# EAGLE design RecoveryBoard (EAGLE 9.6.2)

## Sheet 1 of 2: Power
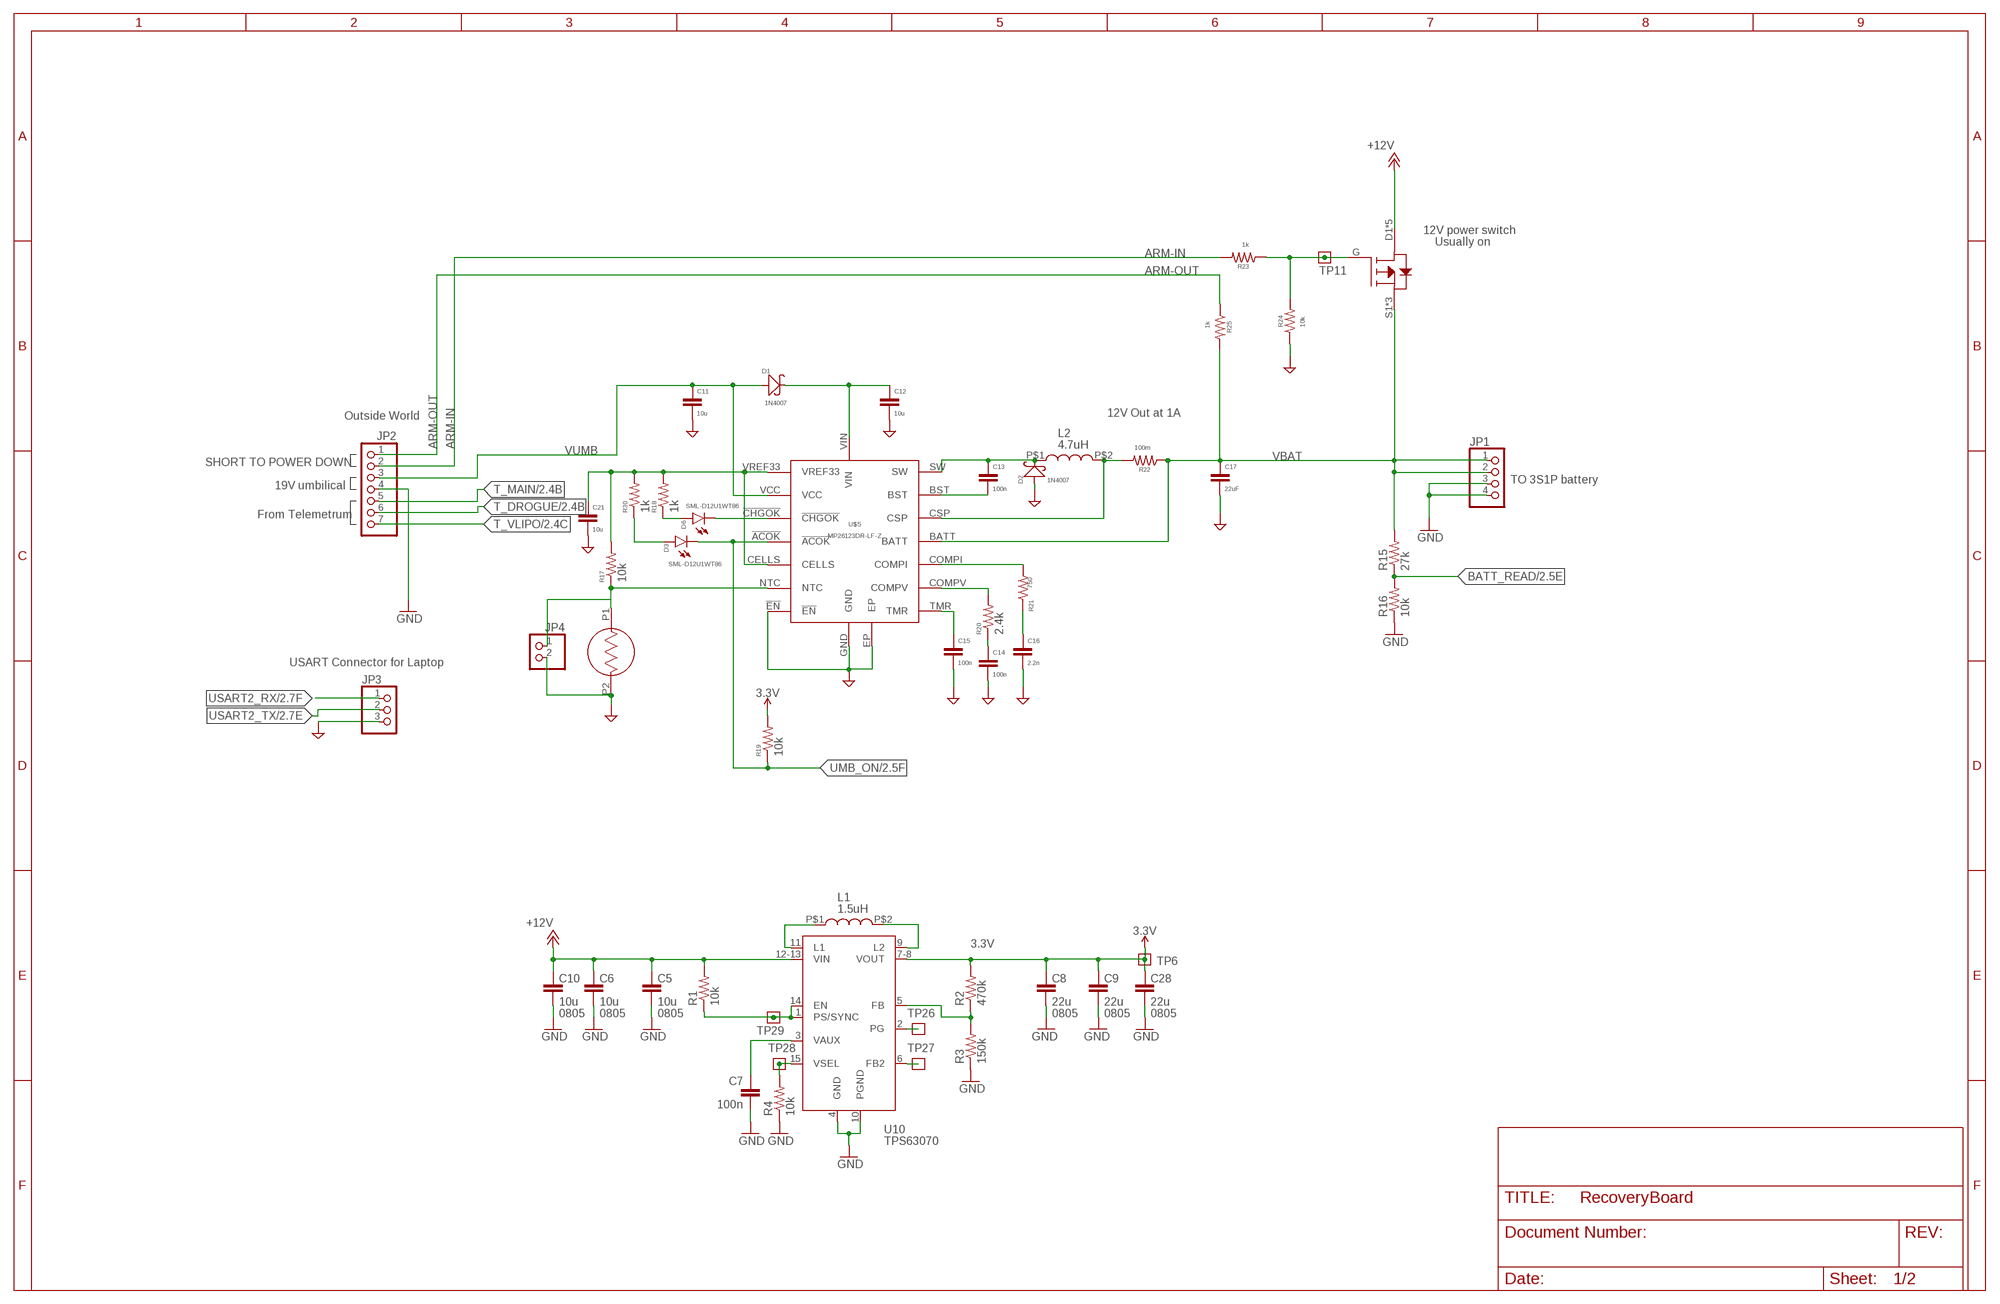
[diagram p0: schematic, sheet 1]

### Parts
C5  10u  C-EU0805-C-NOSILK  [.0805-C-NOSILK]
C6  10u  C-EU0805-C-NOSILK  [.0805-C-NOSILK]
C7  100n  C-EU0603-C-NOSILK  [.0603-C-NOSILK]
C8  22u  C-EU0805-C-NOSILK  [.0805-C-NOSILK]
C9  22u  C-EU0805-C-NOSILK  [.0805-C-NOSILK]
C10  10u  C-EU0805-C-NOSILK  [.0805-C-NOSILK]
C11  10u  C-EU0805-C-NOSILK  [.0805-C-NOSILK]
C12  10u  C-EU0805-C-NOSILK  [.0805-C-NOSILK]
C13  100n  C-EU0603-C-NOSILK  [.0603-C-NOSILK]
C14  100n  C-EU0603-C-NOSILK  [.0603-C-NOSILK]
C15  100n  C-EU0603-C-NOSILK  [.0603-C-NOSILK]
C16  2.2n  C-EU0603-C-NOSILK  [.0603-C-NOSILK]
C17  22uF  C-EU0805-C-NOSILK  [.0805-C-NOSILK]
C21  10u  C-EU0805-C-NOSILK  [.0805-C-NOSILK]
C28  22u  C-EU0805-C-NOSILK  [.0805-C-NOSILK]
D1  1N4007  DIODE-SCHOTTKY-(DO-214AC)  [DO-214AC]
D2  1N4007  DIODE-SCHOTTKY-(DO-214AC)  [DO-214AC]
D3  SML-D12U1WT86  LEDCHIPLED_0603  [CHIPLED_0603]
D6  SML-D12U1WT86  LEDCHIPLED_0603  [CHIPLED_0603]
JP1  PINHD-1X4  [1X04]
JP2  PINHD-1X7  [1X07]
JP3  PINHD-1X3  [1X03]
JP4  PINHD-1X2  [1X02]
L1  1.5uH  IHLP2020CZER1R5M11  [IHLP2020CZER1R5M11]
L2  4.7uH  IHLP2020BZER4R7M11  [IHLP2020BZER4R7M11]
Q7  SI7465DP-T1-E3  [SI7465DP-T1-E3CT-ND]
R1  10k  R-US_0603-C-NOSILK  [.0603-C-NOSILK]
R2  470k  R-US_0603-C-NOSILK  [.0603-C-NOSILK]
R3  150k  R-US_0603-C-NOSILK  [.0603-C-NOSILK]
R4  10k  R-US_0603-C-NOSILK  [.0603-C-NOSILK]
R5  NHQ103B375T10  [NHQ103B375T10]
R15  27k  R-US_0603-C-NOSILK  [.0603-C-NOSILK]
R16  10k  R-US_0603-C-NOSILK  [.0603-C-NOSILK]
R17  10k  R-US_0603-C-NOSILK  [.0603-C-NOSILK]
R18  1k  R-US_0603-C-NOSILK  [.0603-C-NOSILK]
R19  10k  R-US_0603-C-NOSILK  [.0603-C-NOSILK]
R20  2.4k  R-US_0603-C-NOSILK  [.0603-C-NOSILK]
R21  750  R-US_0603-C-NOSILK  [.0603-C-NOSILK]
R22  100m  R-US_1206-C  [1206-C]
R23  1k  R-US_0603-C-NOSILK  [.0603-C-NOSILK]
R24  10k  R-US_0603-C-NOSILK  [.0603-C-NOSILK]
R25  1k  R-US_0603-C-NOSILK  [.0603-C-NOSILK]
R30  1k  R-US_0603-C-NOSILK  [.0603-C-NOSILK]
TP6  TEST-POINT  [2MM-TEST-POINT]
TP11  TEST-POINT  [2MM-TEST-POINT]
TP26  TEST-POINT  [2MM-TEST-POINT]
TP27  TEST-POINT  [2MM-TEST-POINT]
TP28  TEST-POINT  [2MM-TEST-POINT]
TP29  TEST-POINT  [2MM-TEST-POINT]
U10  TPS63070  TPS63070X  [TPS63070X]
U$5  MP26123DR-LF-Z  [MP26123DR-LF-Z]

### Nets
3.3V: C8.1 C9.1 C28.1 R2.2 R19.2 TP6.1 U10.7-8(VOUT) ; also sheet 2
!BEN: C12.1 D1.2(-) U$5.VIN
+12V: C5.1 C6.1 C10.1 Q7.D1(D) Q7.D2(D) Q7.D3(D) Q7.D4(D) Q7.DPAD(D) R1.2 U10.12-13(VIN) ; also sheet 2
ARM-IN: JP2.2 R23.2
ARM-OUT: JP2.1 R25.1
BATT_READ: R15.1 R16.2 ; also sheet 2
GND: C5.2 C6.2 C7.2 C8.2 C9.2 C10.2 C11.2 C12.2 C14.2 C15.2 C16.2 C17.2 C21.2 C28.2 D2.1(+) JP1.3 JP1.4 JP2.4 JP3.3 JP4.2 R3.1 R4.1 R5.P2 R16.1 R24.1 U10.4(GND) U10.10(PGND) U$5.!EN U$5.EP U$5.GND ; also sheet 2
N$10: C13.1 D2.2(-) L2.P$1 U$5.SW
N$11: C13.2 U$5.BST
N$12: C21.1 R17.2 R18.2 R30.2 U$5.CELLS U$5.VREF33
N$13: D6.C U$5.!CHGOK
N$14: D3.A R30.1
N$16: Q7.G R23.1 R24.2 TP11.1
N$17: D6.A R18.1
N$18: R20.2 U$5.COMPV
N$19: C15.1 U$5.TMR
N$20: JP4.1 R5.P1 R17.1 U$5.NTC
N$21: R21.2 U$5.COMPI
N$22: C16.1 R21.1
N$28: L2.P$2 R22.2 U$5.CSP
N$30: C14.1 R20.1
T_DROGUE: JP2.6 ; also sheet 2
T_MAIN: JP2.5 ; also sheet 2
T_VLIPO: JP2.7 ; also sheet 2
TPS-EN: R1.1 TP29.1 U10.1(PS/SYNC) U10.14(EN)
TPS-FB: R2.1 R3.2 U10.5(FB)
TPS-FB2: TP27.1 U10.6(FB2)
TPS-L1: L1.P$1 U10.11(L1)
TPS-L2: L1.P$2 U10.9(L2)
TPS-PG: TP26.1 U10.2(PG)
TPS-VAUX: C7.1 U10.3(VAUX)
TPS-VSEL: R4.2 TP28.1 U10.15(VSEL)
UMB_ON: D3.C R19.1 U$5.!ACOK ; also sheet 2
USART2_RX: JP3.1 ; also sheet 2
USART2_TX: JP3.2 ; also sheet 2
VBAT: C17.1 JP1.1 JP1.2 Q7.S1(S) Q7.S2(S) Q7.S3(S) R15.2 R22.1 R25.2 U$5.BATT
VUMB: C11.1 D1.1(+) JP2.3 U$5.VCC

### Notes on the sheet
- 12V power switch
- Usually on
- Outside World | 12V Out at 1A
- SHORT TO POWER DOWN
- TO 3S1P battery
- 19V umbilical
- From Telemetrum
- USART Connector for Laptop
- 0805 | 0805 | 0805 | 0805 | 0805 | 0805

## Sheet 2 of 2: Microcontroller
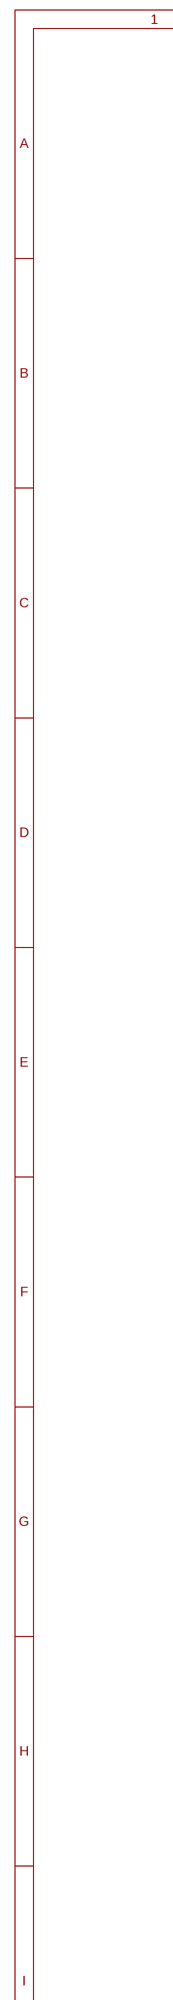
[diagram p1: schematic, sheet 2, part 1 of 2]
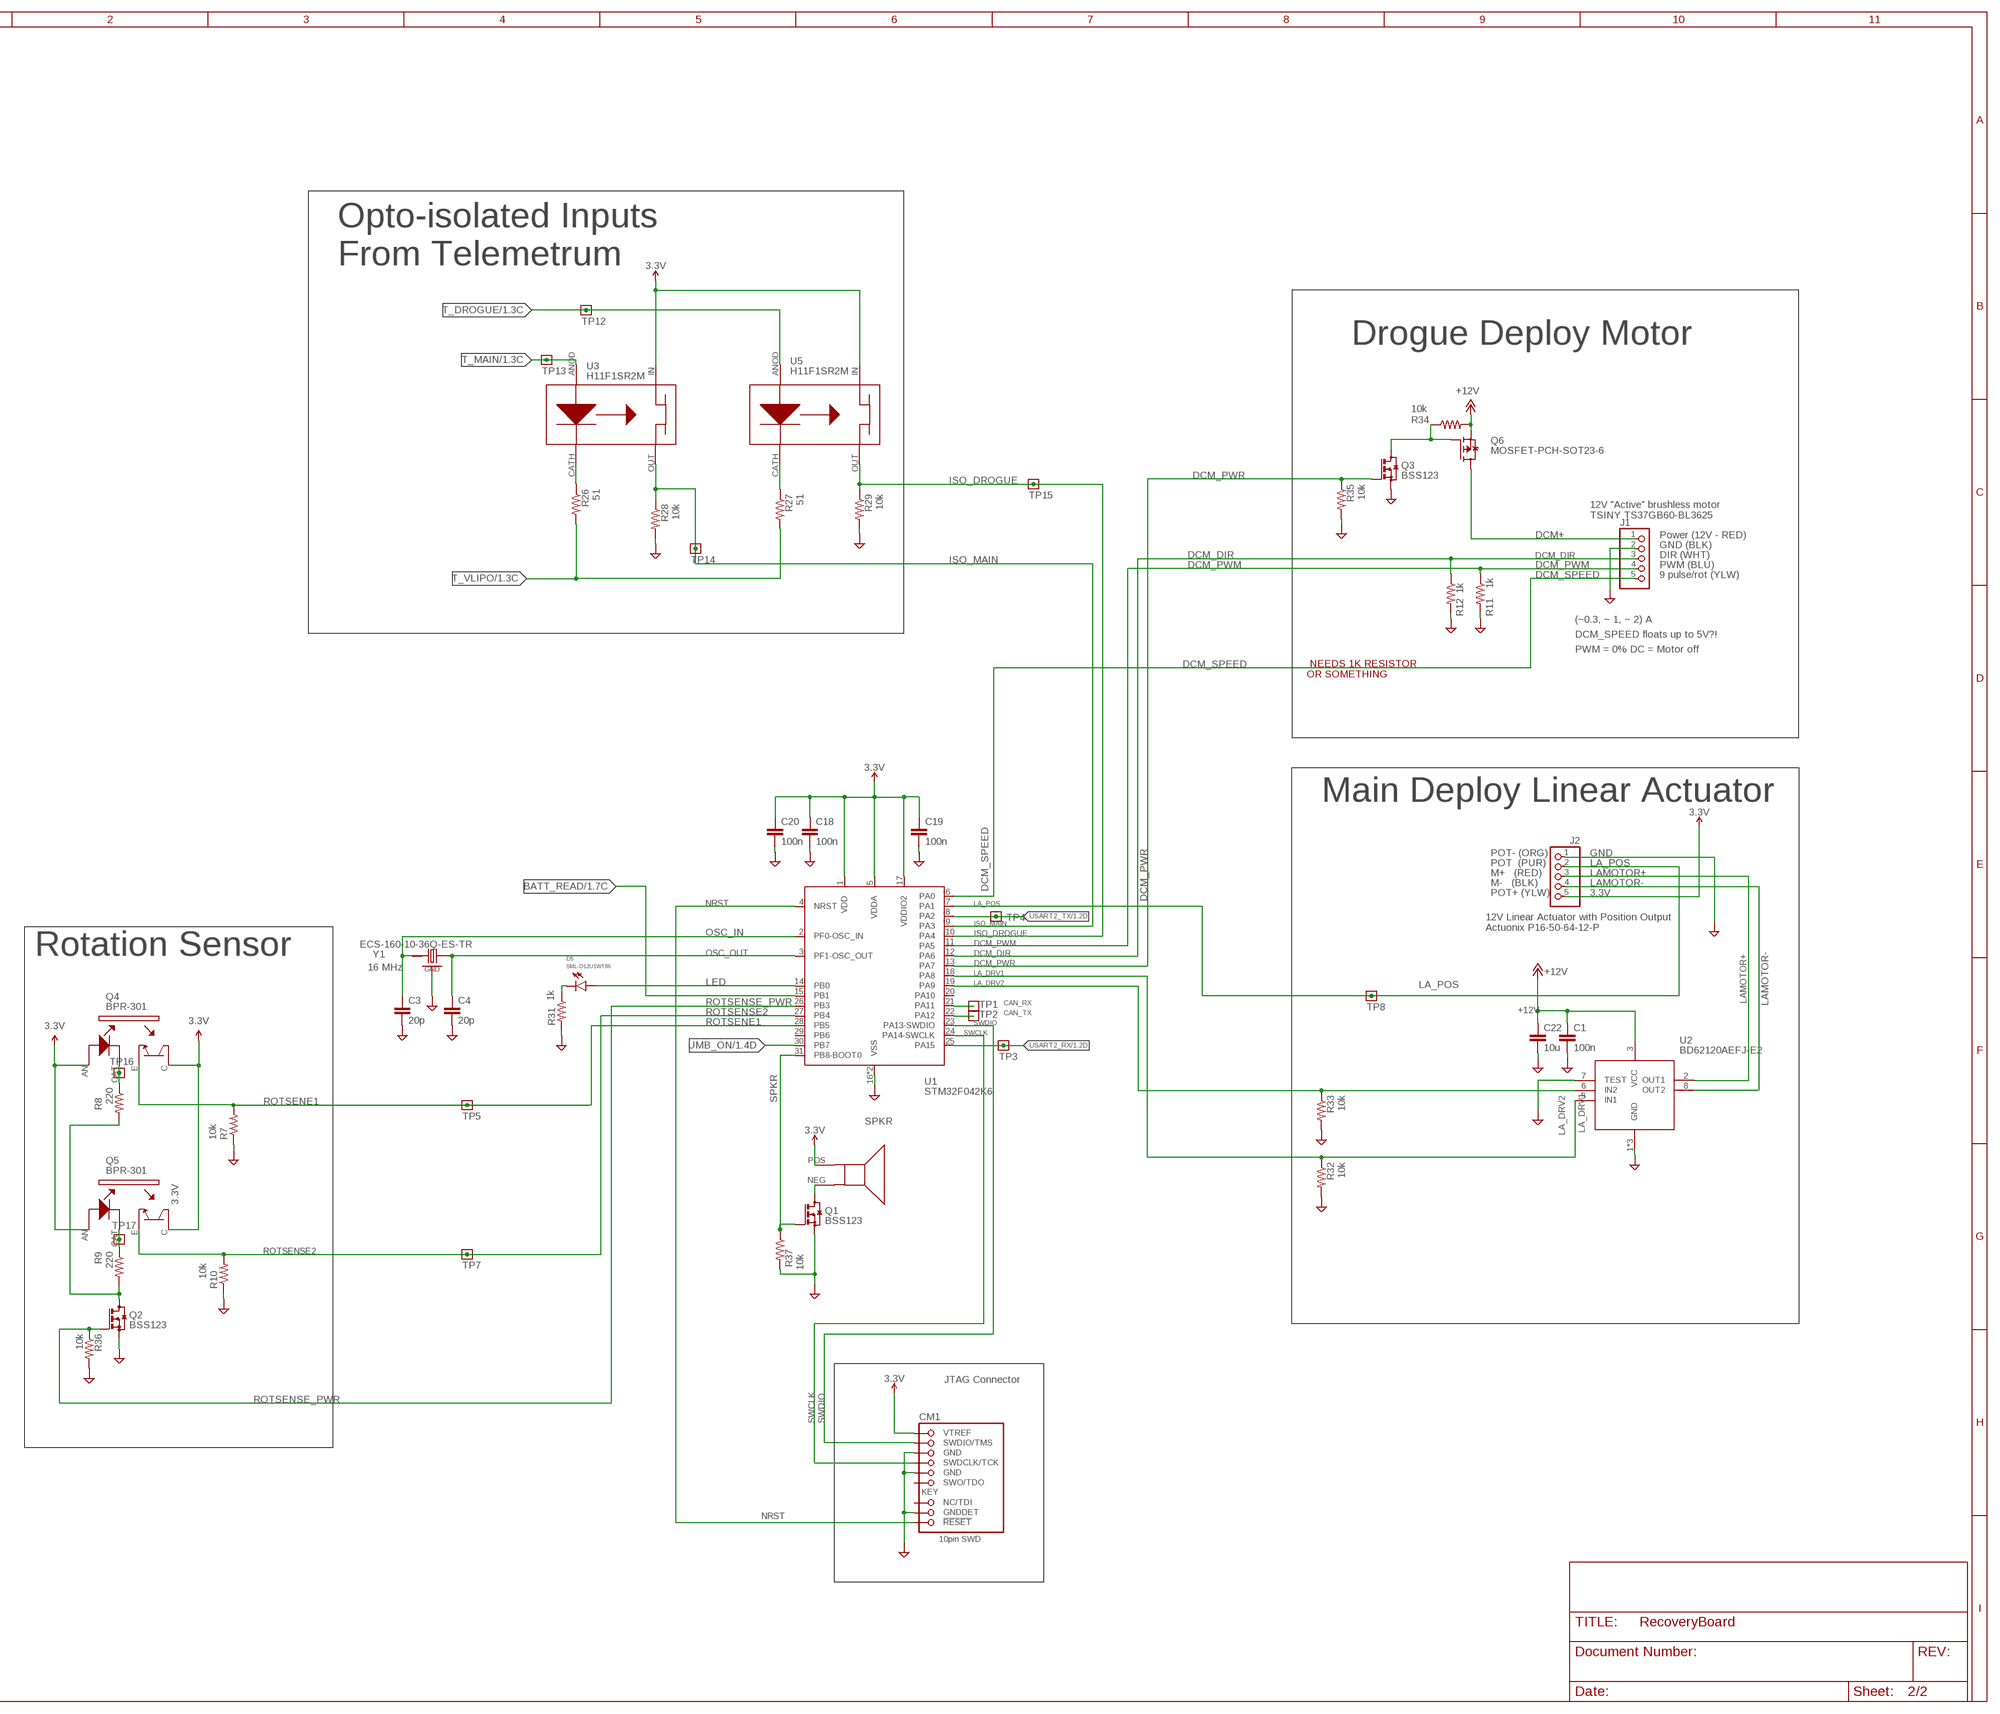
[diagram p2: schematic, sheet 2, part 2 of 2]

### Parts
C1  100n  C-EU0603-C-NOSILK  [.0603-C-NOSILK]
C3  20p  C-EU0603-C-NOSILK  [.0603-C-NOSILK]
C4  20p  C-EU0603-C-NOSILK  [.0603-C-NOSILK]
C18  100n  C-EU0603-C-NOSILK  [.0603-C-NOSILK]
C19  100n  C-EU0603-C-NOSILK  [.0603-C-NOSILK]
C20  100n  C-EU0603-C-NOSILK  [.0603-C-NOSILK]
C22  10u  C-EU0805-A-NOSILK  [.0805-A-NOSILK]
CM1  FTSH-105-XX-X-DV-K  [CON10_2X5_DUK_FTSH]
D5  SML-D12U1WT86  LEDCHIPLED_0603  [CHIPLED_0603]
J1  PINHD-1X5  [1X05]
J2  PINHD-1X5  [1X05]
Q1  BSS123  [SOT23]
Q2  BSS123  [SOT23]
Q3  BSS123  [SOT23]
Q4  BPR-301  [BPR-301]
Q5  BPR-301  [BPR-301]
Q6  MOSFET-PCH-SOT23-6  [SOT23-6]
R7  10k  R-US_0603-C-NOSILK  [.0603-C-NOSILK]
R8  220  R-US_0603-C-NOSILK  [.0603-C-NOSILK]
R9  220  R-US_0603-C-NOSILK  [.0603-C-NOSILK]
R10  10k  R-US_0603-C-NOSILK  [.0603-C-NOSILK]
R11  1k  R-US_0603-C-NOSILK  [.0603-C-NOSILK]
R12  1k  R-US_0603-C-NOSILK  [.0603-C-NOSILK]
R26  51  R-US_0603-C-NOSILK  [.0603-C-NOSILK]
R27  51  R-US_0603-C-NOSILK  [.0603-C-NOSILK]
R28  10k  R-US_0603-C-NOSILK  [.0603-C-NOSILK]
R29  10k  R-US_0603-C-NOSILK  [.0603-C-NOSILK]
R31  1k  R-US_0603-C-NOSILK  [.0603-C-NOSILK]
R32  10k  R-US_0603-C-NOSILK  [.0603-C-NOSILK]
R33  10k  R-US_0603-C-NOSILK  [.0603-C-NOSILK]
R34  10k  R-US_0603-C-NOSILK  [.0603-C-NOSILK]
R35  10k  R-US_0603-C-NOSILK  [.0603-C-NOSILK]
R36  10k  R-US_0603-C-NOSILK  [.0603-C-NOSILK]
R37  10k  R-US_0603-C-NOSILK  [.0603-C-NOSILK]
TP1  TEST-POINT  [2MM-TEST-POINT]
TP2  TEST-POINT  [2MM-TEST-POINT]
TP3  TEST-POINT  [2MM-TEST-POINT]
TP4  TEST-POINT  [2MM-TEST-POINT]
TP5  TEST-POINT  [2MM-TEST-POINT]
TP7  TEST-POINT  [2MM-TEST-POINT]
TP8  TEST-POINT  [2MM-TEST-POINT]
TP12  TEST-POINT  [2MM-TEST-POINT]
TP13  TEST-POINT  [2MM-TEST-POINT]
TP14  TEST-POINT  [2MM-TEST-POINT]
TP15  TEST-POINT  [2MM-TEST-POINT]
TP16  TEST-POINT  [2MM-TEST-POINT]
TP17  TEST-POINT  [2MM-TEST-POINT]
U1  STM32F042K6  [QFP32-7X7]
U2  BD62120AEFJ-E2  [SOIC127P600X100-9N]
U3  H11F1SR2M  [H11F1SR2M]
U5  H11F1SR2M  [H11F1SR2M]
U$7  SMT-0440-S-R  [SMT-0440-S-R]
Y1  ECS-160-10-36Q-ES-TR  [XTAL_ECS-160-10-36Q-ES-TR]

### Nets
3.3V: C18.1 C19.1 C20.1 CM1.1(VTREF) J2.5 Q4.AN(ANOD) Q4.C(COLL) Q5.AN(ANOD) Q5.C(COLL) U1.1(VDD) U1.5(VDDA) U1.17(VDDIO2) U3.IN U5.IN U$7.POS ; also sheet 1
+12V: C1.1 C22.1 Q6.4(S) R34.2 U2.3(VCC) ; also sheet 1
BATT_READ: U1.15(PB1) ; also sheet 1
CAN_RX: TP1.1 U1.21(PA11)
CAN_TX: TP2.1 U1.22(PA12)
DCM+: J1.1 Q6.1(D) Q6.2(D) Q6.5(D) Q6.6(D)
DCM_DIR: J1.3 R12.1 U1.12(PA6)
DCM_PWM: J1.4 R11.1 U1.11(PA5)
DCM_PWR: Q3.1(G) R35.1 U1.13(PA7)
DCM_SPEED: J1.5 U1.6(PA0)
GND: C1.2 C3.2 C4.2 C18.2 C19.2 C20.2 C22.2 CM1.3(GND) CM1.5(GND) CM1.9(GNDDET) J1.2 J2.1 Q1.2(S) Q2.2(S) Q3.2(S) R7.1 R10.1 R11.2 R12.2 R28.2 R29.2 R31.2 R32.2 R33.2 R35.2 R36.2 R37.2 U1.16(VSS) U1.32(VSS) U2.1(GND) U2.4(GND) U2.7(TEST) U2.9(GND) Y1.GND Y1.GND2(GND) ; also sheet 1
ISO_DROGUE: R29.1 TP15.1 U1.10(PA4) U5.OUT
ISO_MAIN: R28.1 TP14.1 U1.9(PA3) U3.OUT
LA_DRV1: R32.1 U1.18(PA8) U2.5(IN1)
LA_DRV2: R33.1 U1.19(PA9) U2.6(IN2)
LA_POS: J2.2 TP8.1 U1.7(PA1)
LAMOTOR+: J2.3 U2.2(OUT1)
LAMOTOR-: J2.4 U2.8(OUT2)
LED: D5.A U1.14(PB0)
N$1: Q1.3(D) U$7.NEG
N$2: Q4.CAT(CATH) R8.1 TP16.1
N$4: D5.C R31.1
N$5: Q5.CAT(CATH) R9.1 TP17.1
N$6: Q3.3(D) Q6.3(G) R34.1
N$7: R26.1 U3.CATH(CAT)
N$26: R27.1 U5.CATH(CAT)
N$27: Q2.3(D) R8.2 R9.2
NRST: CM1.10(!RESET) U1.4(NRST)
OSC_IN: C3.1 U1.2(PF0-OSC_IN) Y1.IN/OUT
OSC_OUT: C4.1 U1.3(PF1-OSC_OUT) Y1.OUT/IN
ROTSENE1: Q4.E(EMIT) R7.2 TP5.1 U1.28(PB5)
ROTSENSE2: Q5.E(EMIT) R10.2 TP7.1 U1.27(PB4)
ROTSENSE_PWR: Q2.1(G) R36.1 U1.26(PB3)
SPKR: Q1.1(G) R37.1 U1.31(PB8-BOOT0)
SWCLK: CM1.4(SWDCLK/TCK) U1.24(PA14-SWCLK)
SWDIO: CM1.2(SWDIO/TMS) U1.23(PA13-SWDIO)
T_DROGUE: TP12.1 U5.ANOD ; also sheet 1
T_MAIN: TP13.1 U3.ANOD ; also sheet 1
T_VLIPO: R26.2 R27.2 ; also sheet 1
UMB_ON: U1.30(PB7) ; also sheet 1
USART2_RX: TP3.1 U1.25(PA15) ; also sheet 1
USART2_TX: TP4.1 U1.8(PA2) ; also sheet 1
Unconnected: CM1.6(SWO/TDO) CM1.8(NC/TDI) U1.20(PA10) U1.29(PB6)

### Notes on the sheet
- Opto-isolated Inputs
  From Telemetrum
- Drogue Deploy Motor
- 12V "Active" brushless motor
  TSINY TS37GB60-BL3625
- Power (12V - RED)
- GND (BLK)
- DIR (WHT)
- PWM (BLU)
- 9 pulse/rot (YLW)
- (~0.3, ~ 1, ~ 2) A
- DCM_SPEED floats up to 5V?!
- PWM = 0% DC = Motor off
- NEEDS 1K RESISTOR 
  OR SOMETHING
- Main Deploy Linear Actuator
- POT- (ORG)
- POT  (PUR)
- M+   (RED)
- M-   (BLK)
- POT+ (YLW)
- 12V Linear Actuator with Position Output
  Actuonix P16-50-64-12-P
- Rotation Sensor
- 16 MHz
- JTAG Connector

## Library data of the parts
C1 C3 C4 C6 C9-C22 C28 = oresat-rcl:C-EU: CAPACITOR, European symbol
C5 C7 C8 = oresat-rcl:C-EU: CAPACITOR, European symbol; DIS: Digi-Key; DPN: 1276-1001-1-ND; MFR: Samsung; MPN: CL05B104KO5NNNC
CM1 = J-Samtec-FTSH-105-XXX-DV-K-ARM-SWD:FTSH-105-XX-X-DV-K
D1 D2 = D-Generic-Schottky-DO-214AC-SMA:DIODE-SCHOTTKY-(DO-214AC): 304010013; MPN: 1N4007
D3 D5 D6 = led:LED: LED OSRAM: - CHIPLED LG R971, LG N971, LY N971, LG Q971, LY Q971, LO R971, LY R971 LH N974, LH R974 LS Q976, LO Q976, LY Q976 LO Q996 - Hyper CHIPLED LW Q18S LB Q993, LB Q99A, LB R99A - SideLED LS A670, LO A670, LY A670, LG A670, LP A670 LB A673, LV A673, LT A673, LW A673 LH A674 LY A675 LS A676, LA A676, LO A676, LY A676, LW A676 LS A679, LY A679, LG A679 - Hyper Micro SIDELED® LS Y876, LA Y876, LO Y876, LY Y876 LT Y87S - SmartLED LW L88C, LW L88S LB L89C, LB L89S, LG L890 LS L89K, LO L89K, LY L89K LS L896, LA L896, LO L896, LY L896 - TOPLED LS T670, LO T670, LY T670, LG T670, LP T670 LSG T670, LSP T670, LSY T670, LOP T670, LYG T670 LG T671, LOG T671, LSG T671 LB T673, LV T673, LT T673, LW T673 LH T674 LS T676, LA T676, LO T676, LY T676, LB T676, LH T676, LSB T676, LW T676 LB T67C, LV T67C, LT T67C, LS T67K, LO T67K, LY T67K, LW E67C LS E67B, LA E67B, LO E67B, LY E67B, LB E67C, LV E67C, LT E67C LW T67C LS T679, LY T679, LG T679 LS T770, LO T770, LY T770, LG T770, LP T770 LB T773, LV T773, LT T773, LW T773 LH T774 LS E675, LA E675, LY E675, LS T675 LS T776, LA T776, LO T776, LY T776, LB T776 LHGB T686 LT T68C, LB T68C - Hyper Mini TOPLED® LB M676 - Mini TOPLED Santana® LG M470 LS M47K, LO M47K, LY M47K Source: http://www.osram.convergy.de LUXEON: - LUMILED® LXK2-PW12-R00, LXK2-PW12-S00, LXK2-PW14-U00, LXK2-PW14-V00 LXK2-PM12-R00, LXK2-PM12-S00, LXK2-PM14-U00 LXK2-PE12-Q00, LXK2-PE12-R00, LXK2-PE12-S00, LXK2-PE14-T00, LXK2-PE14-U00 LXK2-PB12-K00, LXK2-PB12-L00, LXK2-PB12-M00, LXK2-PB14-N00, LXK2-PB14-P00, LXK2-PB14-Q00 LXK2-PR12-L00, LXK2-PR12-M00, LXK2-PR14-Q00, LXK2-PR14-R00 LXK2-PD12-Q00, LXK2-PD12-R00, LXK2-PD12-S00 LXK2-PH12-R00, LXK2-PH12-S00 LXK2-PL12-P00, LXK2-PL12-Q00, LXK2-PL12-R00 Source: www.luxeon.com KINGBRIGHT: KA-3528ASYC Source: www.kingbright.com; DIS: Digikey; DPN: SML-D12U1WT86CT-ND; MPN: SML-D12U1WT86
J1 J2 = pinhead:PINHD-1X5: PIN HEADER
JP1 = pinhead:PINHD-1X4: PIN HEADER
JP2 = pinhead:PINHD-1X7: PIN HEADER
JP3 = pinhead:PINHD-1X3: PIN HEADER
JP4 = pinhead:PINHD-1X2: PIN HEADER
L1 = L--IHLP2020CZER1R5M11--1.5uHInductor:IHLP2020CZER1R5M11; DIS: Digi-Key; DPN: 541-1222-1-ND; MFR: Vishay Dale; MPN: IHLP2020BZER4R7M11
L2 = L--IHLP2020BZER4R7M11--4.7uInductor:IHLP2020BZER4R7M11; DIS: Digi-Key; DPN: 541-1222-1-ND; MFR: Vishay Dale; MPN: IHLP2020BZER4R7M11
Q1-Q3 = transistor-small-signal:BSS123: N-CHANNEL MOS FET
Q4 Q5 = Q--BPR-301--Phototransistor:BPR-301; DATASHEET: http://americanbrightled.com/pdffiles/infrared/BPR-301.pdf; DIS: DigiKey; DPN: BPR-301-ND; MPN: BPR-301
Q6 = Q-MOSFET-PCH-SOT23-6:MOSFET-PCH-SOT23-6: P channel MOSFET in an SOT23-6
Q7 = Q--Si7465DP--Vishay Power MOSFET with multple S+D leads:SI7465DP-T1-E3; DIS: DigiKey; DPN: SI7465DP-T1-E3CT-ND; MFR: Vishay Siliconix; MPN: SI7465DP-T1-E3
R1-R4 R15 R16 = oresat-rcl:R-US_: RESISTOR, American symbol; DIS: Digi-Key; DPN: 1276-4275-1-ND; MFR: Samsung; MPN: RC1005F6653CS
R5 = R--NHQ103B375T10--Thermistor 10K:NHQ103B375T10
R7-R12 R17-R37 = oresat-rcl:R-US_: RESISTOR, American symbol
TP1-TP8 TP11-TP17 TP26-TP29 = Tova:TEST-POINT
U1 = U-ST-STM32F042K-uC:STM32F042K6
U2 = SamacSys_Parts:BD62120AEFJ-E2: ROHM BD62120AEFJ-E2 Motor Driver IC 8-Pin, HTSOP-J Source: Datasheet <https://componentsearchengine.com/Datasheets/1/BD62120AEFJ-E2.pdf>; DESCRIPTION: ROHM BD62120AEFJ-E2 Motor Driver IC 8-Pin, HTSOP-J; HEIGHT: 1mm; MANUFACTURER_NAME: ROHM Semiconductor; MANUFACTURER_PART_NUMBER: BD62120AEFJ-E2; MOUSER_PART_NUMBER: 755-BD62120AEFJ-E2; MOUSER_PRICE-STOCK: https://www.mouser.com/Search/Refine.aspx?Keyword=755-BD62120AEFJ-E2
U3 U5 = Q--H11F1SR2M--OptoIsolator:H11F1SR2M
U10 = ic-pwr-tps63070x:TPS63070X: TPS63070 2-V to 16-V Buck-Boost Converter With 3.6-A Switch Current
U$5 = U--MP26123DR-LF-Z--LiPo Charger:MP26123DR-LF-Z
U$7 = SPK--SMT-0440-S-R--Speaker:SMT-0440-S-R
Y1 = ECS-160-10-36Q-ES-TR:ECS-160-10-36Q-ES-TR: The ECX-2236Q is a miniature SMD Crystal with a 2.5 x 2.0 mm; DESCRIPTION: Crystal 16MHz ±30ppm _Tol_ ±50ppm _Stability_ 10pF FUND 80Ohm Automotive 4-Pin SMD T/R; DIGI-KEY_PART_NUMBER: XC2181CT-ND; DIGI-KEY_PURCHASE_URL: https://www.digikey.com/product-detail/en/ecs-inc/ECS-160-10-36Q-ES-TR/XC2181CT-ND/6134150?utm_source=snapeda&utm_medium=aggregator&utm_campaign=symbol; MF: ECS Inc.; MP: ECS-160-10-36Q-ES-TR; PACKAGE: SMD-4 ECS International

## Board
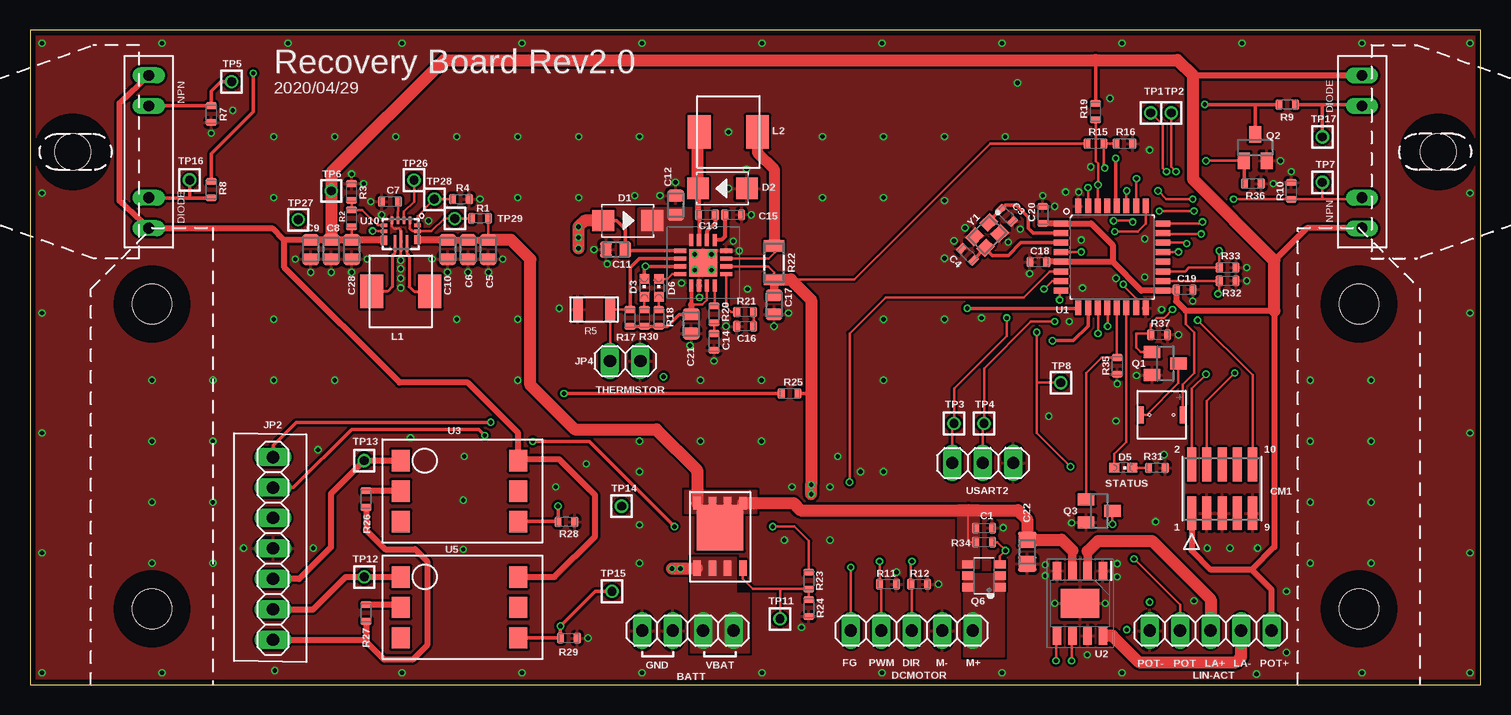
[diagram p3: board, top side]
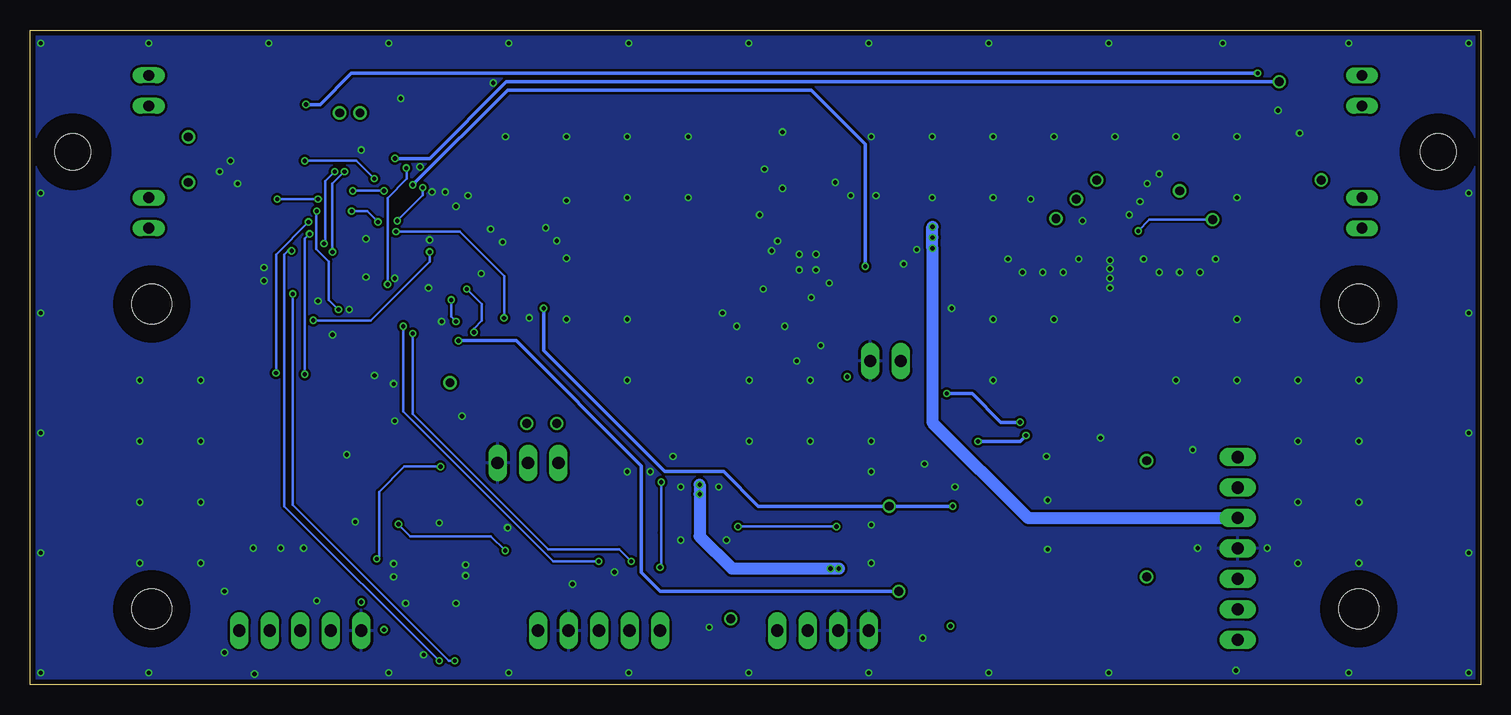
[diagram p4: board, bottom side, seen from below]

Size 120.9 x 54.61 mm. Coordinates in mm from the lower left corner, seen from the top.
Outline: 0,0 120.9,0 120.9,54.61 0,54.61 0,0
Copper layers (1*16): Top 0.035559375mm / dielectric 1.6mm / Bottom 0.035559375mm
Design rules "oshpark-2layer-tented": minimum track width 6mil, minimum drill 10mil, track to track 6mil, track to pad 6mil, pad to pad 6mil, via to via 6mil, smd to smd 6mil, copper to edge 15mil, drill to drill 6mil, minimum pad ring 5mil, minimum via ring 5mil, stop-mask expansion 2.5mil, vias tented up to drill 20mil, thermal gap 10mil
Holes 3 mm at 3.56,44.45 117.35,44.45
Holes 3.3 mm at 10.16,6.35 10.16,31.75 110.74,31.75 110.74,6.35
tKeepout: area 7.2,28.8 to 13.2,34.8; area 7.2,3.3 to 13.2,9.3; area 107.7,3.3 to 113.7,9.3; area 107.7,28.8 to 113.7,34.8; area 114.3,41.5 to 120.3,47.5; area 0.6,41.5 to 6.6,47.5
bKeepout: area 7.2,28.8 to 13.2,34.8; area 7.2,3.3 to 13.2,9.3; area 107.7,3.3 to 113.7,9.3; area 107.7,28.8 to 113.7,34.8; area 114.3,41.5 to 120.3,47.5; area 0.6,41.5 to 6.6,47.5
tRestrict: area 7.2,28.8 to 13.2,34.8; area 7.2,3.3 to 13.2,9.3; area 107.7,3.3 to 113.7,9.3; area 107.7,28.8 to 113.7,34.8; area 114.3,41.5 to 120.3,47.5; area 0.6,41.5 to 6.6,47.5
bRestrict: area 7.2,28.8 to 13.2,34.8; area 7.2,3.3 to 13.2,9.3; area 107.7,3.3 to 113.7,9.3; area 107.7,28.8 to 113.7,34.8; area 114.3,41.5 to 120.3,47.5; area 0.6,41.5 to 6.6,47.5

### Footprints (pad centres in the part's own frame; a part is rotated, then mirrored left to right if it is on the bottom)
.0603-C-NOSILK = smd 0.6 x 0.9: 1 -0.7,0; 2 0.7,0
.0805-C-NOSILK = smd 0.95 x 1.35: 1 -0.8,0; 2 0.8,0
.0805-A-NOSILK = smd 1.35 x 1.55: 1 -1,0; 2 1,0
CON10_2X5_DUK_FTSH = smd 0.762 x 2.794: 1 -2.54,-2.032; 2 -2.54,2.032; 3 -1.27,-2.032; 4 -1.27,2.032; 5 0,-2.032; 6 0,2.032; 7 1.27,-2.032; 8 1.27,2.032; 9 2.54,-2.032; 10 2.54,2.032
DO-214AC = smd 1.8 x 1.77: 1 -2.042,0; 2 2.042,0
CHIPLED_0603 = smd 0.8 x 0.8: A 0,-0.75; C 0,0.75
1X05 = drill 1.016 long: 1 -5.08,0; 2 -2.54,0; 3 0,0; 4 2.54,0; 5 5.08,0
1X04 = drill 1.016 long: 1 -3.81,0; 2 -1.27,0; 3 1.27,0; 4 3.81,0
1X07 = drill 1.016 long: 1 -7.62,0; 2 -5.08,0; 3 -2.54,0; 4 0,0; 5 2.54,0; 6 5.08,0; 7 7.62,0
1X03 = drill 1.016 long: 1 -2.54,0; 2 0,0; 3 2.54,0
1X02 = drill 1.016 long: 1 -1.27,0; 2 1.27,0
IHLP2020CZER1R5M11 = smd 1.905 x 2.79: P$1 -2.42,0; P$2 2.42,0
IHLP2020BZER4R7M11 = smd 1.905 x 2.79: P$1 -2.42,0; P$2 2.42,0
SOT23 = smd 1 x 1.4: 1 -0.95,-1.1; 2 0.95,-1.1; 3 0,1.1
BPR-301 = drill 0.9 long: AN -6.37,0; C 6.37,0; CAT -3.83,0; E 3.83,0
SOT23-6 = smd 0.7 x 1: 1 -0.95,-1.3; 2 0,-1.3; 3 0.95,-1.3; 4 0.95,1.3; 5 0,1.3; 6 -0.95,1.3
SI7465DP-T1-E3CT-ND = smd 1.02 x 0.61: D1 2.055,-1.905; D2 2.055,-0.635; D3 2.055,0.635; D4 2.055,1.905 | smd 3.81 x 3.91: DPAD 0,0 | smd 1.27 x 0.61: G -3.36,-1.905; S1 -3.36,1.905; S2 -3.36,0.635; S3 -3.36,-0.635
NHQ103B375T10 = smd 0.8 x 1.9: P1 -1.35,0; P2 1.35,0
1206-C = smd 0.95 x 1.7: 1 -1.4,0; 2 1.4,0
2MM-TEST-POINT = drill 0.737: 1 0,0
QFP32-7X7 = smd 1.2 x 0.5: 1 -4.25,2.8; 2 -4.25,2; 3 -4.25,1.2; 4 -4.25,0.4; 5 -4.25,-0.4; 6 -4.25,-1.2; 7 -4.25,-2; 8 -4.25,-2.8; 17 4.25,-2.8; 18 4.25,-2; 19 4.25,-1.2; 20 4.25,-0.4; 21 4.25,0.4; 22 4.25,1.2; 23 4.25,2; 24 4.25,2.8 | smd 0.5 x 1.2: 9 -2.8,-4.25; 10 -2,-4.25; 11 -1.2,-4.25; 12 -0.4,-4.25; 13 0.4,-4.25; 14 1.2,-4.25; 15 2,-4.25; 16 2.8,-4.25; 25 2.8,4.25; 26 2,4.25; 27 1.2,4.25; 28 0.4,4.25; 29 -0.4,4.25; 30 -1.2,4.25; 31 -2,4.25; 32 -2.8,4.25
SOIC127P600X100-9N = smd 1.525 x 0.7: 1 -2.712,1.905; 2 -2.712,0.635; 3 -2.712,-0.635; 4 -2.712,-1.905; 5 2.712,-1.905; 6 2.712,-0.635; 7 2.712,0.635; 8 2.712,1.905 | smd 2.4 x 3.2: 9 0,0
H11F1SR2M = smd 1.52 x 1.78: ANOD 0,0; CATH 0,-2.54; IN 9.78,0; OUT 9.78,-5.08; P0 9.78,-2.54; P2 0,-5.08
TPS63070X = smd 0.6 x 0.25: 1 -1.15,0.75; 2 -1.15,0.25; 3 -1.15,-0.25; 4 -1.15,-0.75 | smd 0.25 x 0.6: 5 -0.725,-1.4; 6 -0.225,-1.4; 14 -0.225,1.4; 15 -0.725,1.4 | smd 0.75 x 0.6: 7-8 0.525,-1.4; 12-13 0.475,1.4 | smd 1.35 x 0.25: 9 0.775,-0.5; 11 0.775,0.5 | smd 1.7 x 0.25: 10 0.6,0
MP26123DR-LF-Z = smd 1 x 0.35: !ACOK -1.9,-0.3; !CHGOK -1.9,-0.95; BATT 1.9,-0.3; COMPI 1.9,-0.95; CSP 1.9,0.35; GND 1.9,1; NTC -1.9,0.35; VCC -1.9,1 | smd 0.35 x 1: !EN -0.35,-1.9; BST 0.3,1.9; CELLS 0.3,-1.9; COMPV 0.95,-1.9; SW -0.35,1.9; TMR 0.95,1.9; VIN -1,1.9; VREF33 -1,-1.9 | smd 2.3 x 2.3: EP 0,0
SMT-0440-S-R = smd 0.5 x 1.4: NEG -1.75,0; POS 1.75,0
XTAL_ECS-160-10-36Q-ES-TR = smd 1.2 x 1: GND -0.85,0.65; GND2 0.85,-0.65; IN/OUT -0.85,-0.65; OUT/IN 0.85,0.65

### Placement (x,y rotation side)
C1  79.5,13.07 0 top
C3  81.38,39.14 315 top
C4  78.13,35.89 135 top
C5  38.2,36.3 270 top
C6  36.5,36.3 270 top
C7  30,40.3 180 top
C8  25.1,36.3 270 top
C9  23.4,36.3 270 top
C10  34.8,36.3 270 top
C11  48.8,36.3 180 top
C12  53.8,40 90 top
C13  56.4,39.2 0 top
C14  57,28.6 270 top
C15  58.6,39.2 0 top
C16  59.6,29.9 180 top
C17  62,31.7 270 top
C18  84.03,35.25 180 top
C19  96.22,32.95 0 top
C20  84.4,39.2 90 top
C21  55.1,30.1 270 top
C22  83.1,11.1 270 top
C28  26.8,36.3 270 top
CM1  99.34,16.35 0 top
D1  49.81,38.71 0 top
D2  57.7,41.4 180 top
D3  51.2,33.1 0 top
D5  91.1,18.1 270 top
D6  52.4,33.1 0 top
J1  73.48,4.53 180 top
J2  98.38,4.53 0 top
JP1  54.82,4.53 180 top
JP2  20.25,11.37 270 top
JP3  79.4,18.5 0 top
JP4  49.6,27 0 top
L1  30.9,32.8 180 top
L2  58.2,46.1 0 top
Q1  94.6,26.8 270 top
Q2  102.1,44.8 0 top
Q3  89.1,14.5 270 top
Q4  9.9,44.45 90 top
Q5  111,44.45 270 top
Q6  79.5,9.1 90 top
Q7  57.5,13.1 90 top
R1  37.5,38.9 0 top
R2  26.8,38.9 270 top
R3  26.8,41.1 270 top
R4  35.9,40.5 180 top
R5  47,31.3 180 top
R7  15.1,47.6 90 top
R8  15.1,41.3 90 top
R9  104.77,48.39 180 top
R10  105.1,41.2 270 top
R11  71.5,8.4 0 top
R12  74.1,8.4 0 top
R15  88.79,45.13 180 top
R16  91.2,45.13 180 top
R17  50,30.6 270 top
R18  52.4,30.6 270 top
R19  88.8,47.8 90 top
R20  57,30.9 90 top
R21  59.6,31.1 180 top
R22  62,35.2 90 top
R23  64.9,8.7 90 top
R24  64.9,6.4 90 top
R25  63.3,24.3 0 top
R26  28,15.5 270 top
R27  28,6 270 top
R28  44.7,13.6 0 top
R29  44.9,3.9 0 top
R30  51.2,30.6 270 top
R31  93.9,18.1 0 top
R32  99.8,33.7 0 top
R33  99.8,34.8 0 top
R34  79.5,11.9 180 top
R35  90.6,26.6 270 top
R36  101.9,41.8 0 top
R37  94.1,29.2 0 top
TP1  93.4,47.7 0 top
TP2  95.1,47.7 0 top
TP3  77,21.8 0 top
TP4  79.5,21.8 0 top
TP5  16.8,50.3 0 top
TP6  25.1,41.2 0 top
TP7  107.7,41.9 0 top
TP8  85.9,25.2 0 top
TP11  62.5,5.5 0 top
TP12  27.85,9 0 top
TP13  27.85,18.7 0 top
TP14  49.3,14.9 0 top
TP15  48.5,7.8 0 top
TP16  13.3,42.1 0 top
TP17  107.7,45.7 0 top
TP26  32,42.09 0 top
TP27  22.35,38.79 0 top
TP28  33.7,40.5 0 top
TP29  35.4,38.89 0 top
U1  90.17,35.68 0 top
U2  87.5,6.8 270 top
U3  30.9,18.7 0 top
U5  30.9,9 0 top
U10  30.9,37.6 270 top
U$5  56.1,35.2 0 top
U$7  94.3,22.51 0 top
Y1  79.76,37.52 225 top

### Tracks (layer width: path | path; a pad name or v marks a point on that pad's centre or on a via)
3.3V
  Top 0.2: R2.2 26.82,38.17 26.82,37.08 | U$7.POS 96.05,25.01 96.05,25.05 97,26 97,29.4 96.3,30.1 96.3,31.2
  Top 0.3: R19.2 88.8,52.1
  Top 0.45: U1.17 95.45,32.88
  Top 0.5: CM1.1 96.8,11.2 98.4,9.6 101.8,9.6 | C18.1 84.76,35.28 U1.5 90.22,35.28 | 101.8,9.6 103.7,11.5 103.7,31.2 96.3,31.2 95.5,32 95.5,32.93 C19.1 95.45,32.88 | 90.22,35.28 90.22,36.68 88.42,38.48 U1.1 84.42,38.48 C20.1 | U5.IN 43.7,9 47.1,12.4 47.1,15.8 44.1,18.8 40.78,18.8 | U3.IN 40.68,21 36.48,25.2 30.8,25.2 21.2,34.8 21.2,37.1 | Q4.C 7.45,48.52 7.45,40.38 Q4.AN 20.18,38.08 21.16,37.1 21.2,37.1 | 96.92,50.82 Q5.AN | 90.22,35.28 92.62,32.88 U1.17 | 103.7,35.4 106.38,38.08 Q5.C | C9.1 21.2,37.1 | 25.1,37.5 C8.1 | J2.5 103.46,7.94 101.8,9.6
  Top 0.6: U10.7-8 26.82,37.08 C28.1 C8.1 C9.1
  Top 1: 40.78,18.8 U3.IN | 103.7,31.2 103.7,35.4 96.9,42.2 96.9,50.8 96.92,50.82 95.64,52.1 88.8,52.1 34.5,52.1 25.1,42.7 TP6.1 25.1,37.5
!BEN
  pour Top (isolate 0.2, no thermals): 55.2,36.7 50.7,36.7 50.7,39.7 50.8,39.8 55.2,39.8
+12V
  Top 0.152: R34.2 78.2,11.9 78.2,14.57
  Top 0.2: R1.2 C5.1
  Top 0.6: U10.12-13 34.77,37.12 C10.1 C6.1 C5.1
  Top 0.7: 86.86,11.2 U2.3
  Top 1: C5.1 40.1,37.1 41.7,35.5 41.7,25 45.4,21.3 52.2,21.3 55.59,17.91 55.59,17.8 Q7.D4 | Q7.D1 63.61,15.15 64.2,14.57 78.2,14.57 82.33,14.57 83.1,13.8 C22.1 85.97,12.1 86.86,11.2
  pour Top (isolate 0.2, no thermals): 54.6,14.3 54.6,16.2 60.5,16.2 60.5,14.3
  pour Top (isolate 0.2, no thermals): 79.1,9.7 79.1,15 77.3,15 77.3,9.7
ARM-IN  (via drill 0.35, 0.35 pad 0.25)
  Top 0.2: R23.2 64.9,12 63.7,13.2 v61.9,13.2
  Top 0.3: JP2.2 21.95,16.45 26.8,21.3 37.4,21.3 v37.9,20.8 | v41.9,20.3 46.6,20.3 v53.7,13.2
  Bottom 0.2: v61.9,13.2 v53.7,13.2
  Bottom 0.3: v37.9,20.8 38.4,20.3 v41.9,20.3
ARM-OUT  (via drill 0.35 pad 0.25)
  Top 0.3: R25.1 v44.5,24.3 | v38.4,21.9 22.2,21.9 20.25,19.95 JP2.1
  Bottom 0.3: v44.5,24.3 42.4,24.3 40,21.9 v38.4,21.9
BATT_READ  (via drill 0.35)
  Top 0.2: R16.2 R15.1 89.49,43.16 v89.55,43.1 | U1.15 92.17,32.23 91.1,33.3 v91.1,33.4
  Bottom 0.2: v89.55,43.1 89.5,43.05 89.5,42.2 91.1,40.6 v91.1,33.4
CAN_RX  (via drill 0.35)
  Top 0.2: v94.7,42.8 94.4,43.1 94.4,46.7 TP1.1 | v95.7,36.1 95.68,36.08 U1.21
  Bottom 0.2: v94.7,42.8 95.7,41.8 v95.7,36.1
CAN_TX  (via drill 0.35)
  Top 0.2: U1.22 96.32,36.88 v96.4,36.8 | v95.5,42.8 95.1,43.2 TP2.1
  Bottom 0.2: v96.4,36.8 96.3,36.9 96.3,42 v95.5,42.8
DCM+
  pour Top (isolate 0.2, no thermals): 81.2,9.2 77.8,9.2 77.8,2.4 81.2,2.4
DCM_DIR  (via drill 0.35)
  Top 0.2: J1.3 73.48,8.32 R12.1 73.4,10.2 v73.5,10.3 | v89.8,29.9 89.8,31.4 U1.12
  Bottom 0.2: v89.8,29.9 89.8,22.8 77.3,10.3 v73.5,10.3
DCM_PWM  (via drill 0.35)
  Top 0.2: J1.4 70.94,8.26 R11.1 v70.8,10.3 | v89,29.3 89,31.4 U1.11
  Bottom 0.2: v70.8,10.3 71.8,11.3 77.7,11.3 89,22.6 v89,29.3
DCM_PWR
  Top 0.2: U1.13 90.57,27.33 R35.1 89.3,27.3 88,26 Q3.1
DCM_SPEED  (via drill 0.35)
  Top 0.2: U1.6 84.98,34.48 82.8,32.3 71.3,32.3 68.3,29.3 v68.3,16.9 | v68.4,9.8 J1.5
  Bottom 0.2: v68.3,16.9 68.3,12.7 68.3,9.9 v68.4,9.8
GND  (via drill 0.35)
  Top 0.2: U10.4 30.15,38.25 30.35,38.05 30.75,38.05 30.9,37.9 U10.10 v30.9,35.4 | 56.1,34.6 U$5.EP 55.5,34.6 v55.4,34.6
  other vias: 83.3,34.3 86.8,13.5 87.6,37.1 92.9,37.2 90.5,33.9 100,11.4 94.3,31.3 101.4,33.7 96.9,32 28.4,40.3 75.7,8.4 88.1,2.5 104.7,2.7 102.3,11.4 94.5,19.2 90.6,25.1 92.2,25.8 87.4,41.1 104.2,43.7 93.3,44.6 52.5,40.8 57,27 46.5,3.9 23.6,11.4 24,19.6 101.4,34.8 98.1,11.4 55.4,35.9 56.8,35.9 56.8,34.6 37.5,40.5 16.9,47.9 39.4,35.5 60.1,39.2 53.8,41.9 82.52,38.01 77,37.02 95.7,29.2 105.1,42.8 104.7,7.8 17.8,11.4 36.1,15.4 36.1,11.3 79.3,30.6 111,53.5 90,48.9 1,41 84.6,10 84.6,9.1 72.2,9.4 90.6,10.1 90.6,9 85.4,6.8 89.6,6.8 90.5,22 84.9,22.4 86.6,30.3 88.4,43.2 64.3,4.8 59.1,36.2 58,29.9 55.8,32.3 55,28.3 47,36.3 48.1,35.1 62,29.9 63.2,31 59.8,33 58.6,37 54.3,33.5 44.1,31.4 1,1 1,11 1,21 1,31 1,53.5 11,53.5 21.5,53.5 31,53.5 41,53.5 51,53.5 61,53.5 71,53.5 81,53.5 91,53.5 101,53.5 120,53.5 120,1 120,11 120,21 120,31 120,41 11,1 20.4,1.2 31,1 41,1 51,1 61,1 71,1 81,1 91,1 102.2,0.9 111,1 82.3,50.2 59.7,43 58.2,41.4 58.2,46.1 81.1,13.1 15.1,46 103.6,41.8 50.4,40.8 30.9,34.7 30.9,33.9 30.9,33.1 33.5,35.5 34.8,34.4 36.5,34.4 38.2,34.4 28.1,35.5 26.8,34.4 25.1,34.4 23.4,34.4 22.1,35.5 26.8,42.6 27.8,41.8 29.3,39.2 33.2,38.7 84.4,40.8 85.4,39.9 86.3,41.1 81.52,36.91 77.92,38.11 87.7,33.1 92.9,34 97,7 93.8,13.6 31.7,20.6 60.96,20.32 55.88,20.32 50.8,20.32 50.8,10.16 40.64,25.4 35.56,30.48 20.32,30.48 20.32,25.4 10.16,25.4 10.16,20.32 10.16,15.24 10.16,10.16 111.76,25.4 111.76,20.32 111.76,15.24 111.76,10.16 106.68,15.24 106.68,20.32 106.68,25.4 106.68,10.16 15.24,25.4 15.24,20.32 15.24,15.24 15.24,10.16 25.4,25.4 60.96,25.4 55.88,25.4 71.12,25.4 71.12,30.48 76.2,30.48 76.2,35.56 76.2,40.39 71.12,40.64 66.04,40.64 66.04,45.72 71.12,45.72 76.2,45.72 81.28,45.72 45.72,45.72 50.8,45.72 40.64,45.72 35.56,45.72 30.48,45.72 40.64,40.64 45.72,40.64 40.64,30.48 20.32,40.64 20.32,45.72 25.4,45.72 71.12,17.78 69.22,17.78 67.31,19.05 63.5,16.51 66.67,16.51 66.67,12.06 62.87,12.06 46.35,18.41 43.81,16.51 50.8,13.34 36.2,19.05 50.8,17.78
  pour Top (isolate 0.2, rank 6): 0,0 0,54.61 120.9,54.61 120.9,0
  pour Bottom (isolate 0.2, rank 6): 0,0 0,54.61 120.9,54.61 120.9,0
GND1  (via drill 0.35)
  other vias: 52.8,25.7
GND2  (via drill 0.35)
  other vias: 93.3,6.9
GND3  (via drill 0.35)
  other vias: 91.4,4.6
ISO_DROGUE  (via drill 0.35)
  Top 0.2: U1.10
  Top 0.3: U1.10 88.17,29.93 86.95,28.7 v85.2,28.7 | U5.OUT 44.18,3.92 R29.1 v44.2,4.9 45.25,5.95 47.1,7.8 TP15.1
  Bottom 0.3: TP15.1 68.37,7.8 69.97,9.4 69.97,18.27 80.4,28.7 v85.2,28.7
ISO_MAIN  (via drill 0.35)
  Top 0.2: 87.34,31.4 U1.9
  Top 0.3: U3.OUT 43.98,13.62 R28.1 v44,14.9 | v78.1,31.4 87.34,31.4
  Bottom 0.3: v78.1,31.4 78.1,27.9 68,17.8 63.1,17.8 60.2,14.9 TP14.1 v44,14.9
LA_DRV1  (via drill 0.35)
  Top 0.2: U1.18 99.08,33.68 R32.1 99.1,32.7 v99,32.6 | U2.5 85.5,3.99 v85.5,2
  Bottom 0.2: v85.5,2 86,2 99,15 v99,32.6
LA_DRV2  (via drill 0.35)
  Top 0.2: U1.19 96.26,34.48 96.58,34.8 R33.1 v99.1,36.2 | U2.6 86.8,4.02 v86.8,2
  Bottom 0.2: v86.8,2 99.7,14.9 99.7,35.9 99.4,36.2 v99.1,36.2
LA_POS  (via drill 0.35)
  Top 0.2: J2.2 95.84,6.66 v92,10.5 | v86.7,18.2 83.9,21 83.9,25.1 | 83.9,25.1 v83.9,29.4 | v84.5,33 85.18,33.68 U1.7 | TP8.1 84,25.2 83.9,25.1
  Bottom 0.2: v92,10.5 91.8,10.7 91.8,16.1 89.7,18.2 v86.7,18.2 | v83.9,29.4 83.9,29.72 83.25,30.37 83.25,31.75 v84.5,33
LAMOTOR+
  Top 0.7: 88.14,11.13 U2.2
  Top 1: 88.14,11.13 89,12 93.5,12 98.38,7.12 J2.3
LAMOTOR-
  Top 0.5: 89.8,4.1 U2.8
  Top 1: 89.8,4.1 90.2,4.1 92.4,1.9 100.5,1.9 100.92,2.32 J2.4
LED
  Top 0.2: U1.14 91.37,20.27 90.35,19.25 D5.A
N$1
  Top 0.2: Q1.3 95.7,25.16 93.05,22.51 U$7.NEG
N$2
  Top 0.3: R8.1 13.3,40.6 | 13.3,40.6 9.77,40.6 Q4.CAT | TP16.1 13.3,40.6
N$4
  Top 0.2: R31.1 D5.C
N$5
  Top 0.2: 111.04,48.39 Q5.CAT
  Top 0.3: R9.1 107.7,48.39 | 107.7,48.39 111.04,48.39 | TP17.1 107.7,48.39
N$6  (via drill 0.35)
  Top 0.2: Q3.3 v90.2,13.4 | Q6.3 80.8,10.7 v81.3,11.2 80.6,11.9 R34.1
  Bottom 0.2: v90.2,13.4 89.2,12.4 82.5,12.4 v81.3,11.2
N$7
  Top 0.5: R26.1 30.86,16.2 U3.CATH
N$10
  Top 0.2: C13.1 55.75,39.15
  Top 0.35: 55.75,39.15 U$5.SW
  Top 0.5: 55.7,46.02 L2.P$1 | C13.1 55.7,41.36 55.64,41.42
  Top 1: 55.64,41.42 D2.2 55.66,45.98 55.7,46.02
N$11
  Top 0.35: C13.2 57.1,38.52 56.4,37.82 U$5.BST
N$12
  Top 0.2: U$5.CELLS 56.4,32.1 56,31.7 55.1,31.7
  Top 0.3: C21.1 54.1,30.9 53.1,29.9 R18.2 R30.2 R17.2 | 55.1,31.08 55.19,30.99
  Top 0.35: U$5.VREF33 55.1,31.7 | 55.19,30.99 C21.1
  Top 0.5: 55.1,31.7 55.1,31.08
N$13
  Top 0.2: D6.C 53.1,33.85 53.5,34.25 U$5.!CHGOK
N$14
  Top 0.2: D3.A R30.1
N$16
  Top 0.2: R24.2 R23.1 62.5,8 | Q7.G 59.41,8.84 60.24,8 62.5,8 | TP11.1 62.5,8
N$17
  Top 0.2: R18.1 D6.A
N$18
  Top 0.2: R20.2 57.05,31.65 U$5.COMPV
N$19
  Top 0.35: C15.1 57.9,37.4 57.6,37.1 U$5.TMR
N$20
  Top 0.2: R17.1 R5.P1 48.35,27.02 JP4.1
  Top 0.3: R17.1 50,34.8 50.75,35.55 U$5.NTC
N$21
  Top 0.2: U$5.COMPI 58,31.55 58.45,31.1 R21.2
N$22
  Top 0.2: R21.1 C16.1
N$26
  Top 0.5: R27.1 30.66,6.7 U5.CATH
N$27  (via drill 0.35, 0.35 pad 0.25)
  Top 0.2: v97.9,48.39 v97.9,48.4
  Top 0.3: v97.9,48.39 102.1,48.39 | 102.1,48.39 R9.2 | Q2.3 102.1,48.39 | R8.2 15.1,44.3 18.6,47.8 v18.6,51
  Bottom 0.3: v97.9,48.4 96.73,48.4 94.13,51 v18.6,51
N$28
  Top 0.2: U$5.CSP 61.55,35.55 62.1,36.1 62.1,36.5 R22.2
  Top 0.9: L2.P$2 60.62,44.4 62,43.02 R22.2
N$30
  Top 0.2: R20.1 C14.1
NRST  (via drill 0.35)
  Top 0.2: CM1.10 101.88,25.82 v97.3,30.4 | U1.4 85.94,36.1 v87.6,36.1
  Bottom 0.2: v97.3,30.4 92.5,30.4 87.6,35.3 v87.6,36.1
OSC_IN
  Top 0.3: U1.2 83.62,37.68 83.2,38.1 83.2,39 82.2,40 81.25,40 C3.1 79.9,38.65 Y1.IN/OUT
OSC_OUT
  Top 0.3: U1.3 82.58,36.88 81.5,35.8 80.2,35.8 79.62,36.39 Y1.OUT/IN 78.63,35.47 C4.1
ROTSENE1  (via drill 0.35)
  Top 0.2: U1.28 90.49,40.01
  Top 0.3: 90.49,40.01 v90.49,43.9 | Q4.E 15.08,48.28 R7.2 15.1,49.5 15.9,50.3 TP5.1
  Bottom 0.3: v90.49,43.9 87.6,43.9 81.2,50.3 TP5.1
ROTSENSE2  (via drill 0.35)
  Top 0.2: v91.4,41.2 91.37,41.17 U1.27 | v96.9,40.5 94.7,40.5 v94,41.2 | v100.3,40.5 R10.2 105.12,40.52 107.7,40.52 | 107.7,40.52 111.05,40.52 Q5.E | TP7.1 107.7,40.52
  Bottom 0.2: v94,41.2 v91.4,41.2 | v96.9,40.5 v100.3,40.5
ROTSENSE_PWR  (via drill 0.35)
  Top 0.2: Q2.1 101.1,43.7 v98,43.7 | U1.26 92.17,42.17 v92.21,42.21
  Top 0.3: R36.1 101.2,43.6 101.1,43.7
  Bottom 0.2: v98,43.7 93.7,43.7 v92.21,42.21
SPKR  (via drill 0.35)
  Top 0.2: Q1.1 92.55,27.75 92.17,28.13 92.17,29.3 93.3,29.3 R37.1 93.4,30.1 93.9,30.6 94.5,30.6 v95.2,31.3 | U1.31 v88.17,41.47 | v97,39.5 v94.1,39.5 | v91.9,38.6 91.8,38.7 v90.3,38.7
  Bottom 0.2: v95.2,31.3 96,32.1 96,35.3 97.05,36.35 97.05,39.45 v97,39.5 | v94.1,39.5 92.8,39.5 v91.9,38.6 | v90.3,38.7 88.17,40.83 v88.17,41.47
SWCLK  (via drill 0.35)
  Top 0.2: CM1.4 98.07,23.67 v100.4,26 | U1.24 97.58,38.48 v97.7,38.6
  Bottom 0.2: v100.4,26 100.4,35.9 v97.7,38.6
SWDIO  (via drill 0.35)
  Top 0.2: CM1.2 96.8,24.7 v98,25.9 | v97.6,37.6 94.5,37.6 U1.23
  Bottom 0.2: v98,25.9 98,37.2 v97.6,37.6
T_DROGUE
  Top 0.5: JP2.6 23.59,6.29 26.3,9 TP12.1 U5.ANOD
T_MAIN
  Top 0.5: JP2.5 22.43,8.83 25.1,11.5 25.1,15.95 TP13.1 U3.ANOD
T_VLIPO
  Top 0.5: R26.2 28,12.9 29.6,11.3 32.1,11.3 33.1,10.3 33.1,3.3 31.89,2.09 29.51,2.09 28,3.6 | JP2.7 27.85,3.75 28,3.6 | R27.2 28,3.6
TPS-EN
  Top 0.2: U10.1 31.65,38.05 31.88,37.83 U10.14 33.44,37.83 34.5,38.89 TP29.1 R1.1
TPS-FB
  Top 0.2: R3.2 R2.1 27.7,39.6 28.98,38.33 U10.5
TPS-FB2  (via drill 0.35)
  Top 0.2: U10.6 28.57,37.83 v28.55,37.85
  Bottom 0.2: TP27.1 27.61,38.79 v28.55,37.85
TPS-L1
  Top 0.25: U10.11 31.4,36.02 31.6,35.83 31.6,33.2 32,32.8 L1.P$1
TPS-L2
  Top 0.25: U10.9 30.4,36.02 30.2,35.83 30.2,33.2 29.8,32.8 L1.P$2
TPS-PG
  Top 0.2: U10.2 31.15,39.45 32,40.3 TP26.1
TPS-VAUX
  Top 0.2: U10.3 30.65,39.45 30.7,39.5 C7.1
TPS-VSEL
  Top 0.2: U10.15 32.3,39.1 TP28.1 R4.2
UMB_ON  (via drill 0.35, 0.35 pad 0.25)
  Top 0.2: U1.30 88.97,41.67 v89,41.7 89,43.48 88.8,43.68 R19.1
  Top 0.3: U$5.!ACOK v51.3,34.9 51.2,34.8 D3.C
  Bottom 0.3: v89,41.7 81.1,49.6 55.8,49.6 51.3,45.1 v51.3,34.9
USART2_RX  (via drill 0.35)
  Top 0.2: JP3.1 76.86,21.66 TP3.1 77,24.7 81.4,29.1 v81.4,30.6 | U1.25 92.97,38.47 92.3,37.8 v90.4,37.8
  Bottom 0.2: v81.4,30.6 81.4,34.1 85.1,37.8 v90.4,37.8
USART2_TX  (via drill 0.35)
  Top 0.2: JP3.2 79.4,21.7 TP4.1 79.5,26.4 83.4,30.3 v85.4,30.3 | v85.8,32.1 85.8,32.76 U1.8
  Bottom 0.2: v85.8,32.1 85.8,30.7 v85.4,30.3
VBAT  (via drill 0.35)
  Top 0.2: R15.2 80.03,45.13 68.7,33.8 63.4,33.8 | U$5.BATT 61.5,34.9 62,34.4 R22.1
  Top 0.3: R25.2 65.1,24.3
  Top 0.7: C17.1 R22.1
  Top 1: v65.1,15.9 v65.1,16.7 65.1,24.3 65.1,32.1 63.4,33.8 R22.1 | v53.5,9.7 v54.2,9.7 55.55,9.7 Q7.S1
  Bottom 1: v65.1,16.7 v65.1,15.9 65.1,12.4 62.4,9.7 v54.2,9.7 v53.5,9.7
  pour Top (no thermals): 55.1,7 55.1,2.7 59.9,2.7 59.9,7.6 58.8,7.6 58.8,10.6 55.1,10.6
VUMB  (via drill 0.35)
  Top 0.3: U$5.VCC 49.7,36.2 C11.1 49.6,38 48.9,38.7 47.76,38.7
  Top 1: 47.76,38.7 D1.1 46.21,38.71 v45.7,38.2 v45.7,36.4
  Bottom 1: JP2.3 37.71,13.91 45.7,21.9 v45.7,36.4 v45.7,37.3 v45.7,38.2

### Text on the board
tPlace: Recovery Board Rev2.0 | 2020/04/29 | THERMISTOR | USART2 | STATUS | FG | PWM | DIR | M- | M+ | POT- | POT | LA+ | LA- | POT+ | GND | VBAT | BATT | DCMOTOR | LIN-ACT
Document: 3.3 SPS | LiPo